# Altium schematic sheet Sheet1.SchDoc
size A
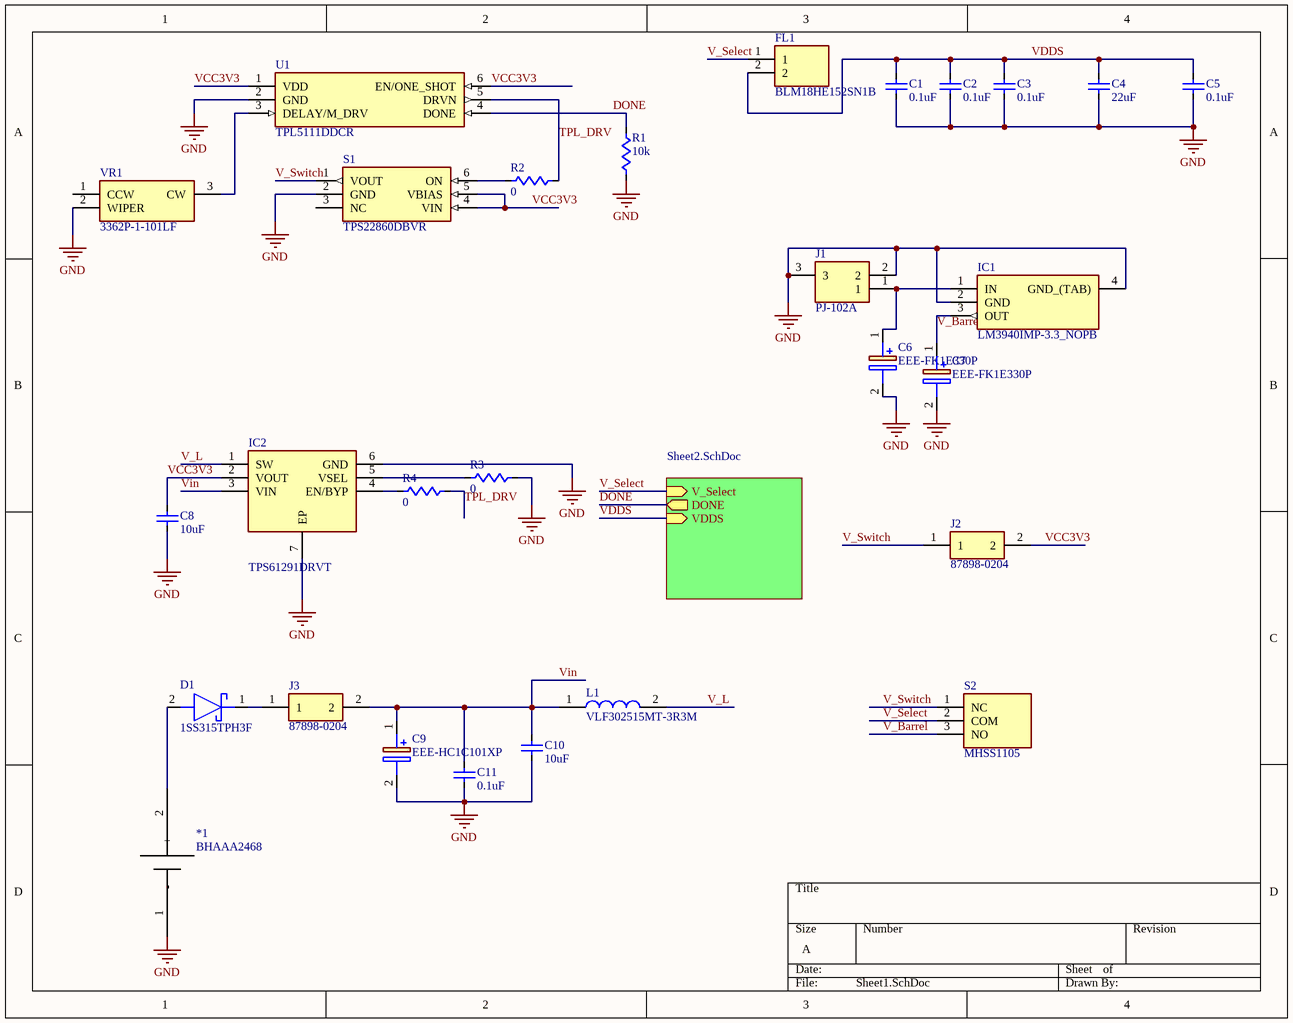
[diagram p0: Sheet1.SchDoc]

## Parts
*1  BHAAA2468  [BHAAA2468]
C1  value 0.1uF  [PASSIVE-CAPACITOR-0603]  (hidden comment: Passive-Capacitor (Generic))
C2  value 0.1uF  [PASSIVE-CAPACITOR-0603]  (hidden comment: Passive-Capacitor (Generic))
C3  value 0.1uF  [PASSIVE-CAPACITOR-0603]  (hidden comment: Passive-Capacitor (Generic))
C4  value 22uF  [PASSIVE-CAPACITOR-0603]
C5  value 0.1uF  [PASSIVE-CAPACITOR-0603]  (hidden comment: Passive-Capacitor (Generic))
C6  EEE-FK1E330P  [CAPAE660X610N]
C7  EEE-FK1E330P  [CAPAE660X610N]
C8  value 10uF  [PASSIVE-CAPACITOR-0603]  (hidden comment: Passive-Capacitor (Generic))
C9  EEE-HC1C101XP  [CAPAE660X800N]
C10  value 10uF  [PASSIVE-CAPACITOR-0603]  (hidden comment: Passive-Capacitor (Generic))
C11  value 0.1uF  [PASSIVE-CAPACITOR-0603]  (hidden comment: Passive-Capacitor (Generic))
D1  1SS315TPH3F  [SOD2513X110N]
FL1  BLM18HE152SN1B  [BEADC1608X95N]
IC1  LM3940IMP-3.3_NOPB  [SOT230P700X180-4N]
IC2  TPS61291DRVT  [SON65P200X200X80-7N]
J1  PJ-102A  [PJ-102AH]
J2  87898-0204  [878980204]
J3  87898-0204  [878980204]
L1  VLF302515MT-3R3M  [VLF302515MT]
R1  value 10k  [PASSIVE-RESISTOR-0603]  (hidden comment: Passive-Resistor (Generic))
R2  value 0  [PASSIVE-RESISTOR-0603]  (hidden comment: Passive-Resistor (Generic))
R3  value 0  [PASSIVE-RESISTOR-0603]  (hidden comment: Passive-Resistor (Generic))
R4  value 0  [PASSIVE-RESISTOR-0603]  (hidden comment: Passive-Resistor (Generic))
S1  TPS22860DBVR  [SOT95P280X145-6N]
S2  MHSS1105  [MHSS1105]
U1  TPL5111DDCR  [SOT95P280X110-6N]
VR1  3362P-1-101LF  [3362P1101LF]

## Sub-sheets
Sheet2.SchDoc = Sheet2.SchDoc: V_Select (in), DONE (out), VDDS (in)

## Nets
GND: *1.1(-) C1.1 C2.1 C3.1 C4.2 C5.1 C6.2(-) C7.2(-) C8.1 C9.2(-) C10.1 C11.1 IC1.2(GND) IC1.4(GND_(TAB)) IC2.6(GND) IC2.7(EP) J1.2 J1.3 R1.1 R3.2 S1.2(GND) U1.2(GND) VR1.2(WIPER)
DONE: R1.2 U1.4(DONE) ; sheet Sheet2.SchDoc/DONE
TPL_DRV: R2.2 R4.2 U1.5(DRVN)
V_Barrel: C7.1(+) IC1.3(OUT) S2.3(NO)
V_L: IC2.1(SW) L1.2
V_Select: FL1.1 S2.2(COM) ; sheet Sheet2.SchDoc/V_Select
V_Switch: J2.1 S1.1(VOUT) S2.1(NC)
VCC3V3: C8.2 IC2.2(VOUT) J2.2 S1.4(VIN) S1.5(VBIAS) U1.1(VDD) U1.6(EN/ONE_SHOT)
VDDS: C1.2 C2.2 C3.2 C4.1 C5.2 FL1.2 ; sheet Sheet2.SchDoc/VDDS
Vin: C9.1(+) C10.2 C11.2 IC2.3(VIN) J3.2 L1.1
Net*1_2: *1.2(+) D1.2(A)
NetC6_1: C6.1(+) IC1.1(IN) J1.1
NetD1_1: D1.1(K) J3.1
NetIC2_4: IC2.4(EN/BYP) R4.1
NetIC2_5: IC2.5(VSEL) R3.1
NetR2_1: R2.1 S1.6(ON)
NetU1_3: U1.3(DELAY/M_DRV) VR1.3(CW)

Not connected (* = marked no-connect by the designer): S1 3(NC); VR1 1(CCW)

## Library data of the parts
C1-C5 C8 C10 C11 = Passive-Capacitor (Generic): Generic Capacitor; Category: Passive; Manufacturer: *; Manufacturer Part Number: *; Supplier 2: Digi-Key; Package: *; Through Hole (y/n): *; Supplier 1: Mouser; Supplier Part Number 1: *; Supplier Part Number 2: *
C6 C7 = EEE-FK1E330P: Capacitor Polarised; Manufacturer_Name: Panasonic; Allied_Number: 70258257; Datasheet Link: https://industrial.panasonic.com/cdbs/www-data/pdf/RDE0000/ABA0000C1181.pdf; Height: 6.1mm; Manufacturer_Part_Number: EEE-FK1E330P; Mouser Part Number: 667-EEE-FK1E330P; Mouser Price/Stock: https://www.mouser.com/Search/Refine.aspx?Keyword=667-EEE-FK1E330P; Allied Price/Stock: https://www.alliedelec.com/panasonic-eee-fk1e330p/70258257/
C9 = EEE-HC1C101XP: Capacitor Polarised; Manufacturer_Name: Panasonic; Allied_Number: 70258549; Datasheet Link: http://industrial.panasonic.com/www-cgi/jvcr13pz.cgi?E+PZ+3+ABA0109+EEEHC1C101XP+7+WW; Height: 8mm; Manufacturer_Part_Number: EEE-HC1C101XP; Mouser Part Number: 667-EEE-HC1C101XP; Mouser Price/Stock: https://www.mouser.com/Search/Refine.aspx?Keyword=667-EEE-HC1C101XP; Allied Price/Stock: https://www.alliedelec.com/panasonic-eee-hc1c101xp/70258549/
D1 = 1SS315TPH3F: Schottky Diode; Manufacturer_Name: Toshiba; Datasheet Link: http://toshiba.semicon-storage.com/info/docget.jsp?did=2666&prodName=1SS315; Height: 1.1mm; Manufacturer_Part_Number: 1SS315TPH3F; Mouser Part Number: 757-1SS315TPH3F; Mouser Price/Stock: https://www.mouser.com/Search/Refine.aspx?Keyword=757-1SS315TPH3F
FL1 = BLM18HE152SN1B: Filter; Manufacturer_Name: Murata Electronics; Datasheet Link: https://www.murata.com/en-us/products/productdetail?partno=BLM18HE152SN1%23; Height: 0.95mm; Manufacturer_Part_Number: BLM18HE152SN1B; Mouser Part Number: N/A; Mouser Price/Stock: https://www.mouser.com/Search/Refine.aspx?Keyword=N%2FA
IC1 = LM3940IMP-3.3_NOPB: Integrated Circuit; Manufacturer_Name: Texas Instruments; Manufacturer_Part_Number: LM3940IMP-3.3/NOPB; Datasheet Link: http://www.ti.com/lit/ds/symlink/lm3940.pdf; Height: 1.8mm; Mouser Part Number: 926-LM3940IMP3.3NOPB; Mouser Price/Stock: https://www.mouser.com/Search/Refine.aspx?Keyword=926-LM3940IMP3.3NOPB; RS Part Number: 5361546P; RS Price/Stock: http://uk.rs-online.com/web/p/products/5361546P
IC2 = TPS61291DRVT: Integrated Circuit; Manufacturer_Name: Texas Instruments; Datasheet Link: http://uk.rs-online.com/web/p/products/9143112P; Height: 0.8mm; Manufacturer_Part_Number: TPS61291DRVT; Mouser Part Number: 595-TPS61291DRVT; Mouser Price/Stock: https://www.mouser.com/Search/Refine.aspx?Keyword=595-TPS61291DRVT; RS Part Number: 9143112P; RS Price/Stock: http://uk.rs-online.com/web/p/products/9143112P
J1 = PJ-102A: Connector; Manufacturer_Name: CUI; Datasheet Link: https://www.cui.com/product/resource/pj-102a.pdf; Manufacturer_Part_Number: PJ-102A; Mouser Part Number: 490-PJ-102A; Mouser Price/Stock: https://www.mouser.com/Search/Refine.aspx?Keyword=490-PJ-102A
J2 J3 = 87898-0204: Connector; Manufacturer_Name: Molex; Allied_Number: 70967354; Datasheet Link: https://www.molex.com/pdm_docs/sd/878980204_sd.pdf; Height: 8.33mm; Manufacturer_Part_Number: 87898-0204; Mouser Part Number: 538-87898-0204; Mouser Price/Stock: https://www.mouser.com/Search/Refine.aspx?Keyword=538-87898-0204; Allied Price/Stock: https://www.alliedelec.com/molex-incorporated-87898-0204/70967354/
L1 = VLF302515MT-3R3M: Inductor; Manufacturer_Name: TDK; Datasheet Link: https://product.tdk.com/info/en/documents/wdcatalog/withdrawn_inductor_commercial_power_vlf302515mt_en.pdf; Manufacturer_Part_Number: VLF302515MT-3R3M; Mouser Part Number: 810-VLF302515MT-3R3M; Mouser Price/Stock: https://www.mouser.com/Search/Refine.aspx?Keyword=810-VLF302515MT-3R3M
R1-R4 = Passive-Resistor (Generic): Generic Resistor; Through Hole (y/n): N; Category: Passive; Manufacturer: *; Manufacturer Part Number: *; Package: *; Supplier 1: Mouser; Supplier 2: Digi-Key; Supplier Part Number 1: *; Supplier Part Number 2: *
S1 = TPS22860DBVR: Switch; Manufacturer_Name: Texas Instruments; Datasheet Link: http://www.ti.com/lit/gpn/tps22860; Height: 1.45mm; Manufacturer_Part_Number: TPS22860DBVR; Mouser Part Number: 595-TPS22860DBVR; Mouser Price/Stock: https://www.mouser.com/Search/Refine.aspx?Keyword=595-TPS22860DBVR
S2 = MHSS1105: Switch; Manufacturer_Name: Apem; Datasheet Link: https://componentsearchengine.com/Datasheets/2/MHSS1105.pdf; Height: 4mm; Manufacturer_Part_Number: MHSS1105; Mouser Part Number: 642-MHSS1105; Mouser Price/Stock: https://www.mouser.com/Search/Refine.aspx?Keyword=642-MHSS1105
U1 = TPL5111DDCR: Undefined or Miscellaneous; Manufacturer_Name: Texas Instruments; Datasheet Link: http://www.ti.com/lit/ds/symlink/tpl5111.pdf; Height: 1.1mm; Manufacturer_Part_Number: TPL5111DDCR; Mouser Part Number: 595-TPL5111DDCR; Mouser Price/Stock: https://www.mouser.com/Search/Refine.aspx?Keyword=595-TPL5111DDCR
VR1 = 3362P-1-101LF: Variable Resistor; Manufacturer_Name: Bourns; Allied_Number: 70154047; Datasheet Link: https://www.bourns.com/docs/Product-Datasheets/3362.pdf; Height: 4.95mm; Manufacturer_Part_Number: 3362P-1-101LF; Mouser Part Number: 652-3362P-1-101LF; Mouser Price/Stock: https://www.mouser.com/Search/Refine.aspx?Keyword=652-3362P-1-101LF; RS Part Number: 5220877P; RS Price/Stock: http://uk.rs-online.com/web/p/products/5220877P; Allied Price/Stock: https://www.alliedelec.com/bourns-3362p-1-101lf/70154047/